# Altium schematic sheet MotionSensorEasyEDA.schdoc
size 143 x 84 mm
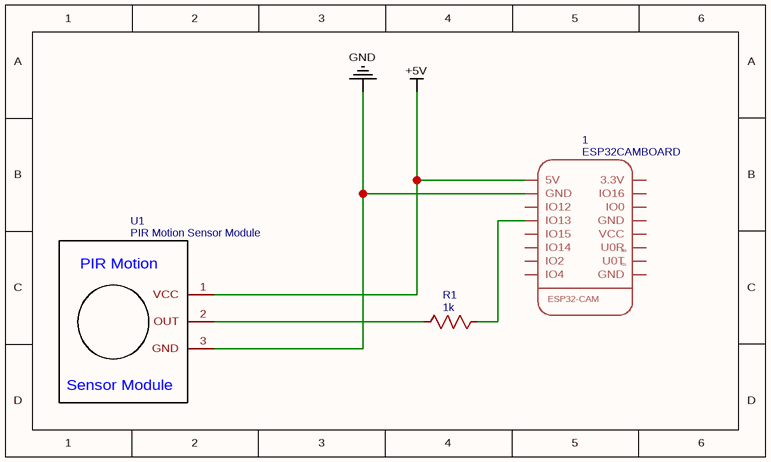
[diagram p0: MotionSensorEasyEDA.schdoc]

## Parts
1  ESP32CAMBOARD  [ESP32CAM_BOARD]
R1  1k  [R0603]
U1  PIR Motion Sensor Module  [PIRMOTIONSENSOR]

## Nets
+5V: 1.5V U1.1(VCC)
GND: 1.GND@1(GND) U1.3(GND)
Net1_IO13: 1.IO13 R1.2
NetR1_1: R1.1 U1.2(OUT)

Not connected (* = marked no-connect by the designer): 1 3.3V GND@2(GND) GND@3(GND) IO0 IO2 IO4 IO12 IO14 IO15 IO16 UDR(U0R) UDT(U0T) VCC

## Notes on the sheet
- (in symbol ESP32CAMBOARD) IO3; IO1; ESP32-CAM
- (in symbol PIR Motion Sensor Module) PIR Motion; Sensor Module

## Library data of the parts
1 = ESP32CAMBOARD: Contributor: sakuyaki; spicePre: ?; spiceSymbolName: ESP32CAMBOARD
R1 = 1k: nameAlias: Value(Ω); Contributor: LCEDA_Lib; spicePre: R; spiceSymbolName: R_0603_US
U1 = PIR Motion Sensor Module: Contributor: Bradenjarvis2; spicePre: U; spiceSymbolName: PIR Motion Sensor Module